# Altium schematic sheet NODE_3_SCH.SchDoc
size A2; SheetNumber: 1; SheetTotal: 1; SPICEModelCacheSGLVFROD: <root> / <DocumentId>SGLVFROD</DocumentId> / <CacheFrame Number="0"> / <Model Name="xtal" Kind="CKT"> / <Text>*Generic type:crystal pkg:HC33/51 / .SUBCKT XTAL 1 2 PARAMS: FREQ=1Meg RS=750 C=13pf Q=1000 / LX 1 3 {((Q*RS)/(6.2831852*FREQ))} IC=0.5M / CX 3 4 {(1/(Q*6.2831852*FREQ*RS))} / C0 1 2 {C} / RS 4 2 {RS} / .ENDS XTAL</Text> / </Model> / </CacheFrame> / </root>
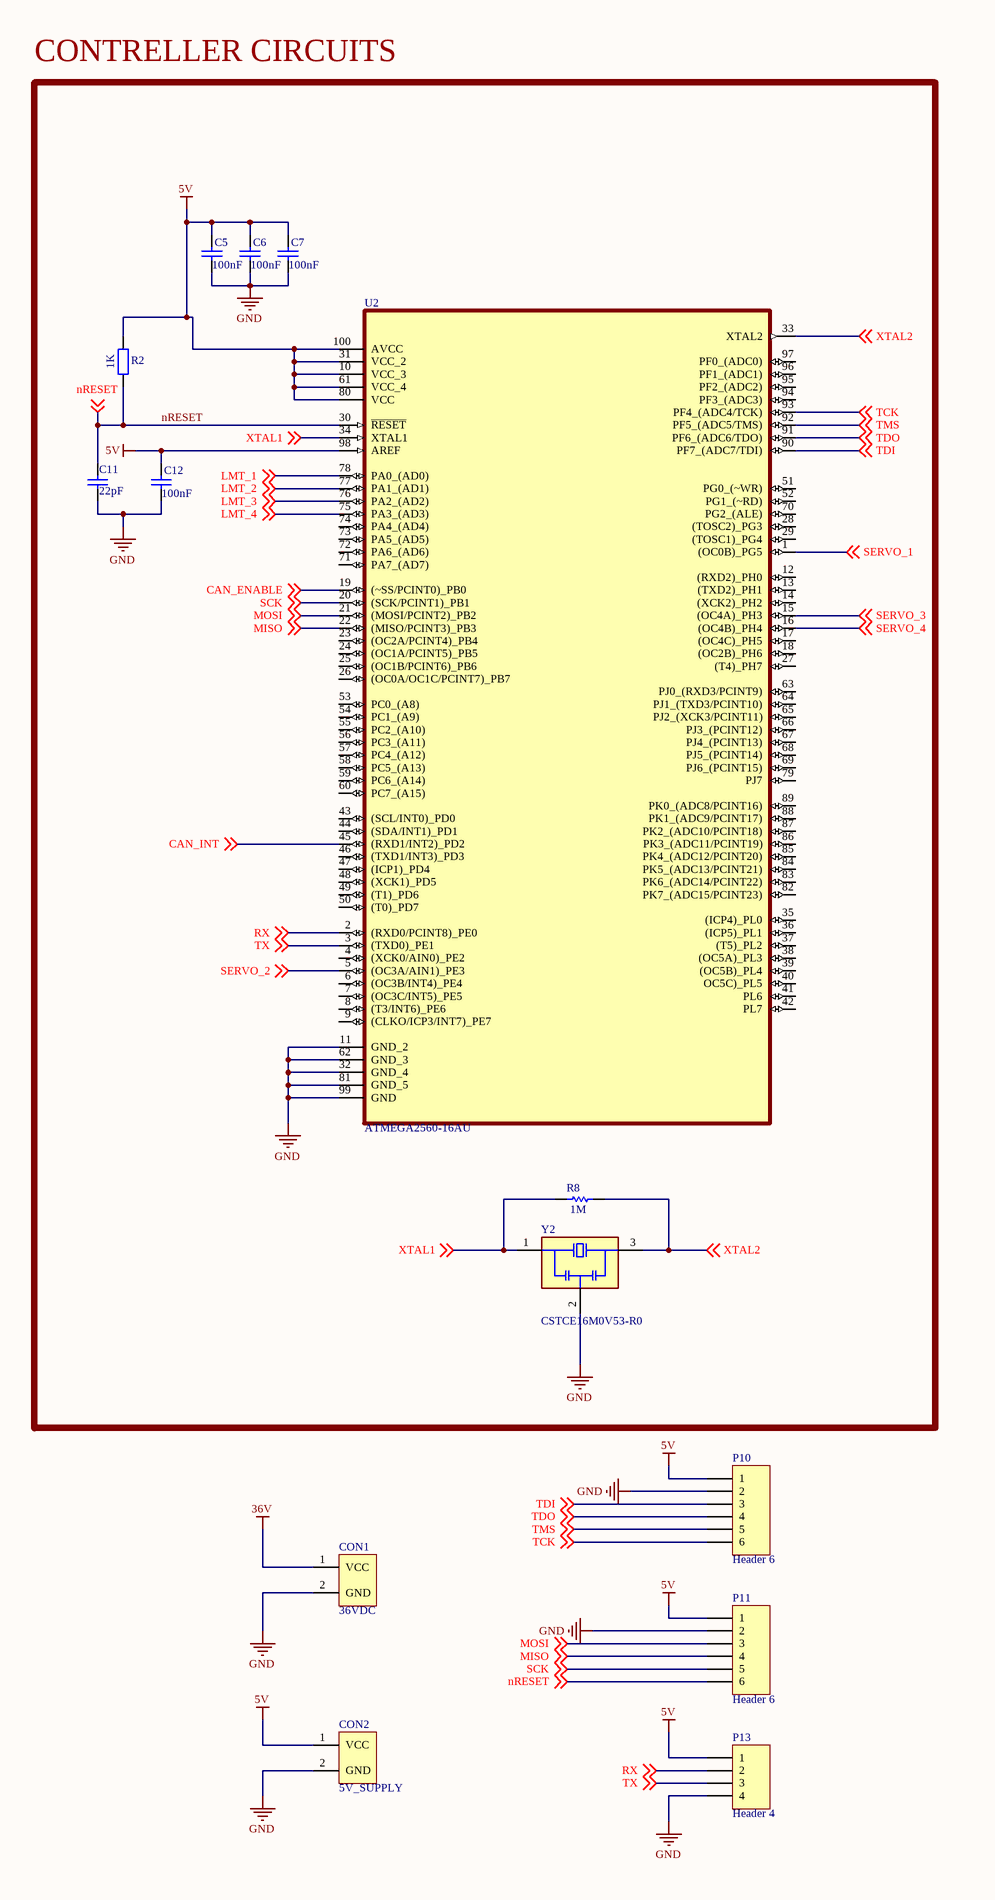
[diagram p0: NODE_3_SCH.SchDoc, left]
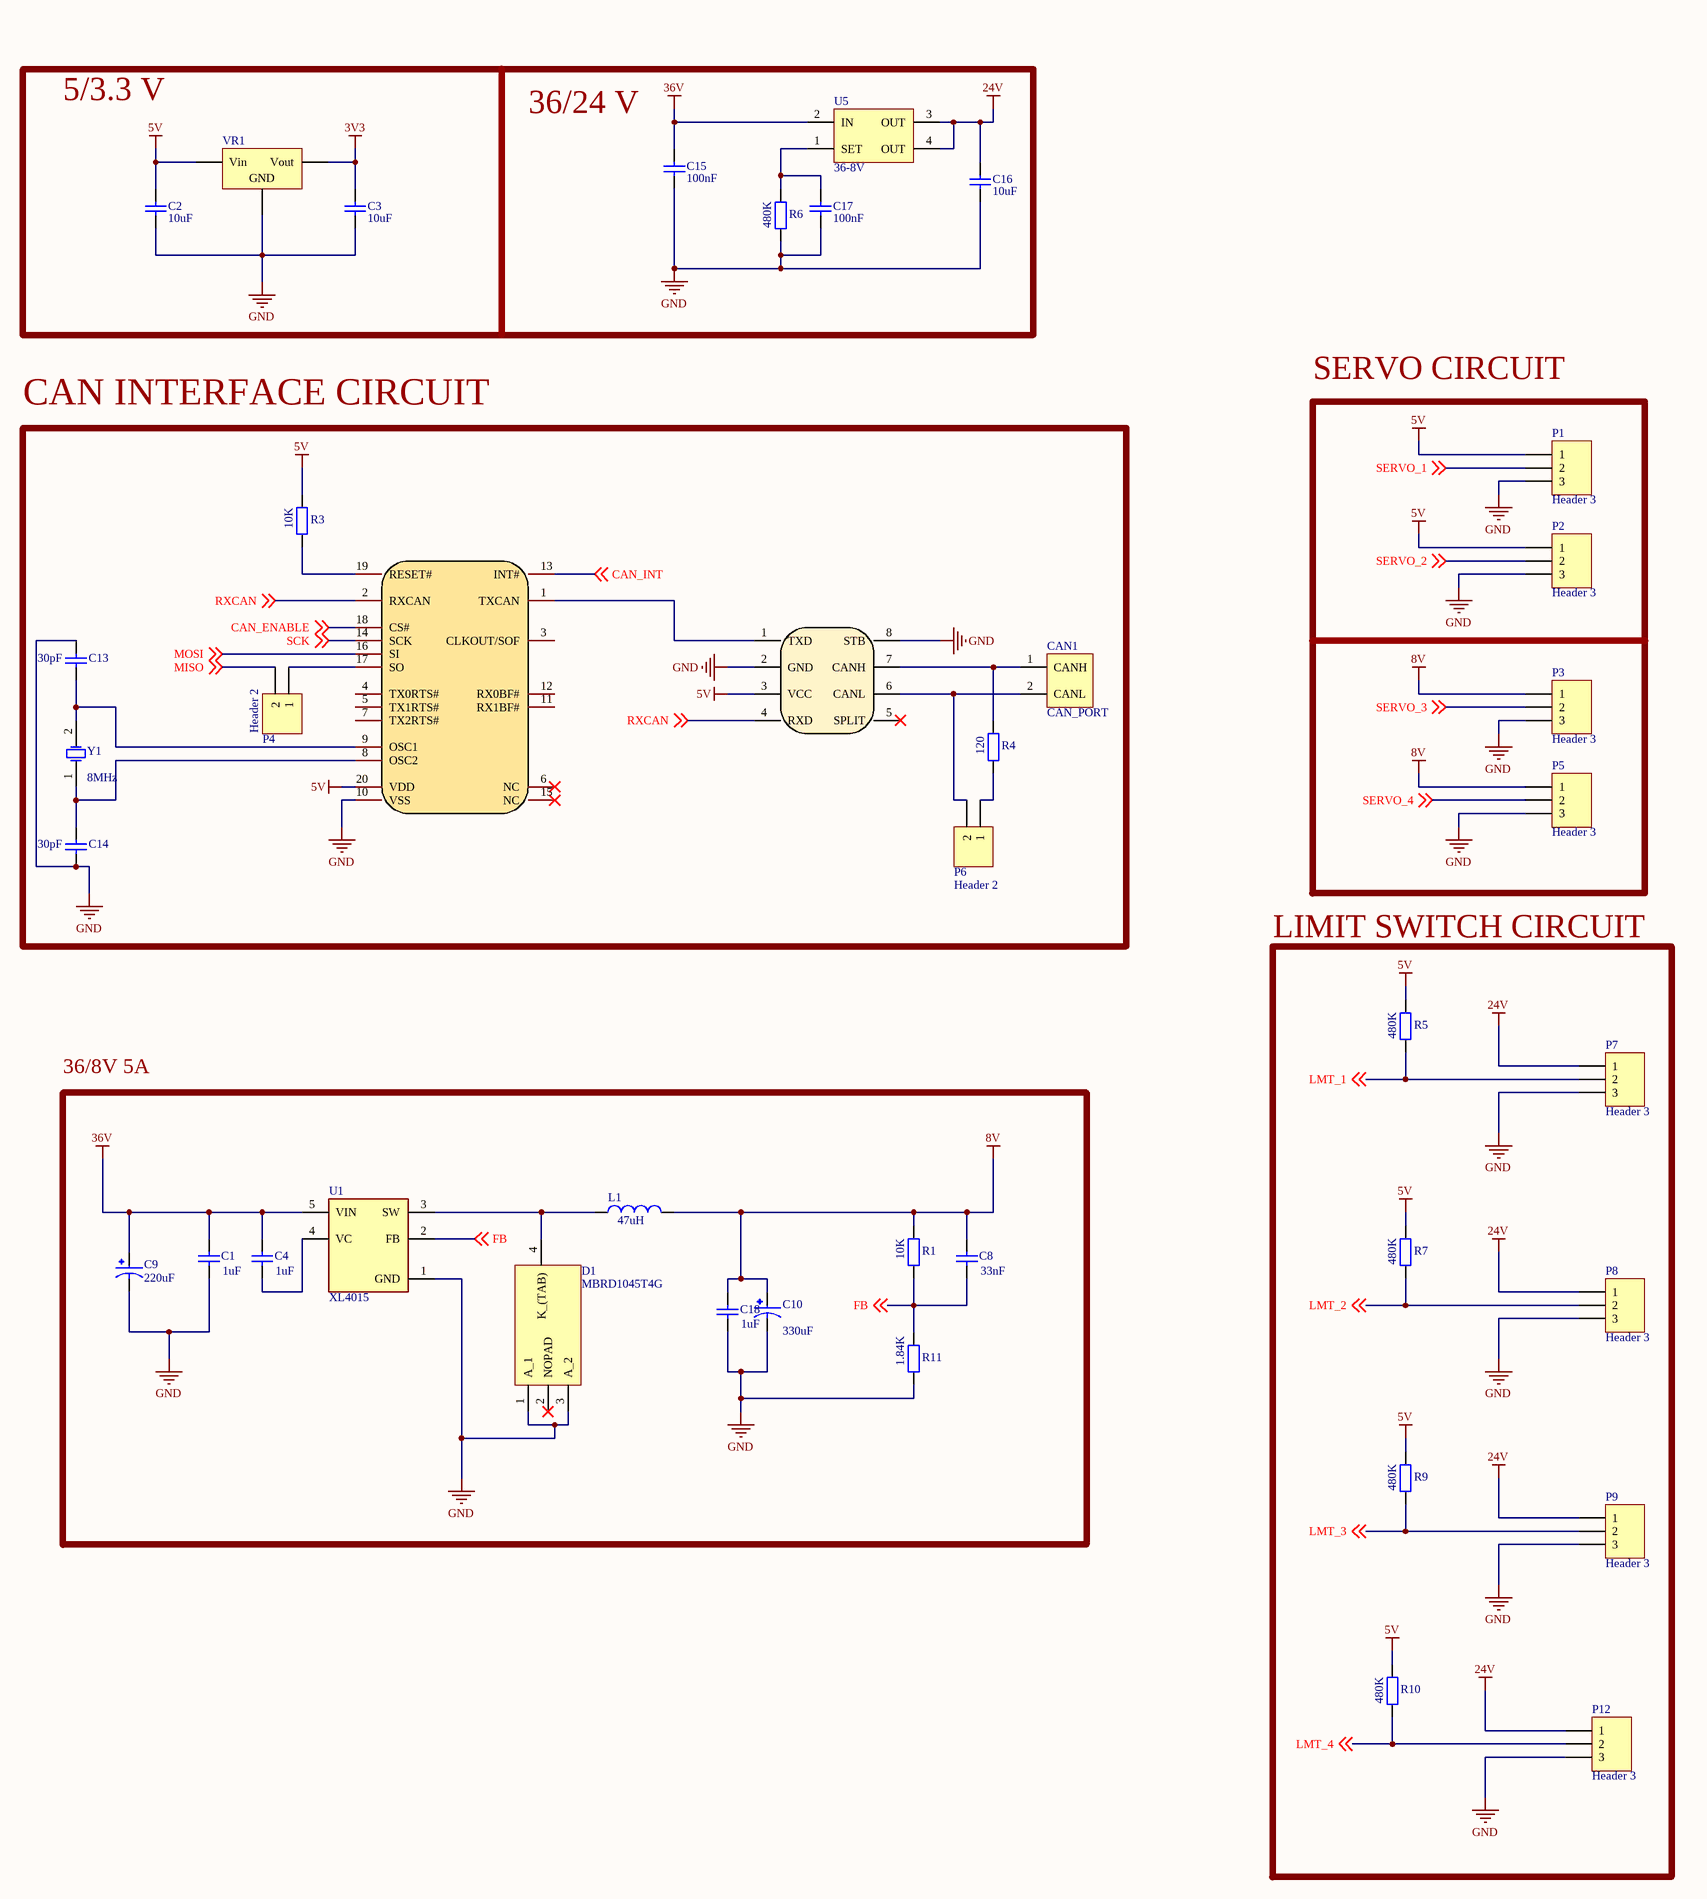
[diagram p1: NODE_3_SCH.SchDoc, right]

## Parts
C1  value 1uF  [CAPC2012X135N]  (hidden comment: Cap)
C2  value 10uF  [CAPC2012X135N]  (hidden comment: Cap)
C3  value 10uF  [CAPC2012X135N]  (hidden comment: Cap)
C4  value 1uF  [CAPC2012X135N]  (hidden comment: Cap)
C5  value 100nF  [CAPC2012X135N]  (hidden comment: Cap)
C6  value 100nF  [CAPC2012X135N]  (hidden comment: Cap)
C7  value 100nF  [CAPC2012X135N]  (hidden comment: Cap)
C8  value 33nF  [CAPC2012X135N]  (hidden comment: Cap)
C9  value 220uF  [CAP_EEVTG1H221Q]  (hidden comment: EEVTG1H221Q)
C10  value 330uF  [CAP_EEEFN1E331V]  (hidden comment: EEEFN1E331V)
C11  value 22pF  [CAPC2012X135N]  (hidden comment: Cap)
C12  value 100nF  [CAPC2012X135N]  (hidden comment: Cap)
C13  value 30pF  [CAPC2012X135N]  (hidden comment: Cap)
C14  value 30pF  [CAPC2012X135N]  (hidden comment: Cap)
C15  value 100nF  [CAPC2012X135N]  (hidden comment: Cap)
C16  value 10uF  [CAPC2012X135N]  (hidden comment: Cap)
C17  value 100nF  [CAPC2012X135N]  (hidden comment: Cap)
C18  value 1uF  [CAPC2012X135N]  (hidden comment: Cap)
CAN1  CAN_PORT  [12V_CON]
CON1  36VDC  [12V_CON]
CON2  5V_SUPPLY  [12V_CON]
D1  MBRD1045T4G  [TO229P990X238-4N]
L1  value 47uH  [IND_MWSA1206S_SNL]  (hidden comment: Inductor)
P1  Header 3  [3PIN_H]
P2  Header 3  [3PIN_H]
P3  Header 3  [3PIN_H]
P4  Header 2  [SAMTEC_TS-102-G-A]
P5  Header 3  [3PIN_H]
P6  Header 2  [SAMTEC_TS-102-G-A]
P7  Header 3  [3PIN_H]
P8  Header 3  [3PIN_H]
P9  Header 3  [3PIN_H]
P10  Header 6  [HDR1X6]
P11  Header 6  [HDR1X6]
P12  Header 3  [3PIN_H]
P13  Header 4  [HDR1X4]
R1  value 10K  [RESC2013X06N]  (hidden comment: Res2)
R2  value 1K  [RESC2013X06N]  (hidden comment: Res2)
R3  value 10K  [RESC2013X06N]  (hidden comment: Res2)
R4  value 120  [CRCW1206120RFKEAHP]  (hidden comment: Res2)
R5  value 480K  [CRCW1206120RFKEAHP]  (hidden comment: Res2)
R6  value 480K  [CRCW1206120RFKEAHP]  (hidden comment: Res2)
R7  value 480K  [CRCW1206120RFKEAHP]  (hidden comment: Res2)
R8  value 1M  [RESC2013X06N]  (hidden comment: Res1)
R9  value 480K  [CRCW1206120RFKEAHP]  (hidden comment: Res2)
R10  value 480K  [CRCW1206120RFKEAHP]  (hidden comment: Res2)
R11  value 1.84K  [0603_STANDARD]  (hidden comment: Res2)
U1  XL4015  [CONV_XL4015]
U2  ATMEGA2560-16AU  [QFP50P1600X1600X120-100N]
U3  TJA1050DRG  [SOP-8_L4.9-W3.9-P1.27-LS6.0-BL - duplicate]  (value not drawn)
U4  MCP2515T-I/ST  [TSSOP-20_L6.5-W4.4-P0.65-LS6.4-BL]  (value not drawn)
U5  36-8V  [SOT-223-3_L6.5-W3.4-P2.30-LS7.0-BR]
VR1  5-3.3V  [TO-252-2_L6.6-W6.1-P4.57-LS9.9-BR-CW]  (value not drawn)
Y1  value 8MHz  [CRYSTAL-SMD_L7.4-W4.0-LS8.0]  (hidden comment: XTAL)
Y2  CSTCE16M0V53-R0  [OSC_CSTCE16M0V53-R0]

## Blocks framed on the sheet
CONTRELLER CIRCUITS: C5-C7 C11 C12 R2 R8 U2 Y2
SERVO CIRCUIT: P1-P3 P5
CAN INTERFACE CIRCUIT: C13 C14 CAN1 P4 P6 R3 R4 U3 U4 Y1
LIMIT SWITCH CIRCUIT: P7-P9 P12 R5 R7 R9 R10
36/8V 5A: C1 C4 C8-C10 C18 D1 L1 R1 R11 U1

## Nets
3V3: C3.2 VR1.3(Vout)
5V: C2.2 C5.1 C6.1 C7.1 C12.1 CON2.1(VCC) P1.1 P2.1 P10.1 P11.1 P13.1 R2.2 R3.2 R5.2 R7.2 R9.2 R10.2 U2.10(VCC_3) U2.31(VCC_2) U2.61(VCC_4) U2.80(VCC) U2.98(AREF) U2.100(AVCC) U3.3(VCC) U4.20(VDD) VR1.1(Vin)
8V: C8.1 C10.1 C18.1 L1.2 P3.1 P5.1 R1.2
24V: C16.2 P7.1 P8.1 P9.1 P12.1 U5.3(OUT) U5.4(OUT)
36V: C1.1 C4.1 C9.1 C15.2 CON1.1(VCC) U1.5(VIN) U5.2(IN)
GND: C1.2 C2.1 C3.1 C5.2 C6.2 C7.2 C9.2 C10.2 C11.2 C12.2 C13.1 C14.2 C15.1 C16.1 C17.1 C18.2 CON1.2(GND) CON2.2(GND) D1.1(A_1) D1.3(A_2) P1.3 P2.3 P3.3 P5.3 P7.3 P8.3 P9.3 P10.2 P11.2 P12.3 P13.4 R6.1 R11.1 U1.1(GND) U2.11(GND_2) U2.32(GND_4) U2.62(GND_3) U2.81(GND_5) U2.99(GND) U3.2(GND) U3.8(STB) U4.10(VSS) VR1.2(GND) Y2.2(GND)
CAN_ENABLE: U2.19((~SS/PCINT0)_PB0) U4.18(CS#) ; off-sheet CAN_ENABLE
CAN_INT: U2.45((RXD1/INT2)_PD2) U4.13(INT#) ; off-sheet CAN_INT
FB: C8.2 R1.1 R11.2 U1.2(FB) ; off-sheet FB
LMT_1: P7.2 R5.1 U2.78(PA0_(AD0)) ; off-sheet LMT_1
LMT_2: P8.2 R7.1 U2.77(PA1_(AD1)) ; off-sheet LMT_2
LMT_3: P9.2 R9.1 U2.76(PA2_(AD2)) ; off-sheet LMT_3
LMT_4: P12.2 R10.1 U2.75(PA3_(AD3)) ; off-sheet LMT_4
MISO: P4.2 P11.4 U2.22((MISO/PCINT3)_PB3) ; off-sheet MISO
MOSI: P11.3 U2.21((MOSI/PCINT2)_PB2) U4.16(SI) ; off-sheet MOSI
nRESET: C11.1 P11.6 R2.1 U2.30(~{RESET}) ; off-sheet nRESET
RX: P13.2 U2.2((RXD0/PCINT8)_PE0) ; off-sheet RX
RXCAN: U3.4(RXD) U4.2(RXCAN) ; off-sheet RXCAN
SCK: P11.5 U2.20((SCK/PCINT1)_PB1) U4.14(SCK) ; off-sheet SCK
SERVO_1: P1.2 U2.1((OC0B)_PG5) ; off-sheet SERVO_1
SERVO_2: P2.2 U2.5((OC3A/AIN1)_PE3) ; off-sheet SERVO_2
SERVO_3: P3.2 U2.15((OC4A)_PH3) ; off-sheet SERVO_3
SERVO_4: P5.2 U2.16((OC4B)_PH4) ; off-sheet SERVO_4
TCK: P10.6 U2.93(PF4_(ADC4/TCK)) ; off-sheet TCK
TDI: P10.3 U2.90(PF7_(ADC7/TDI)) ; off-sheet TDI
TDO: P10.4 U2.91(PF6_(ADC6/TDO)) ; off-sheet TDO
TMS: P10.5 U2.92(PF5_(ADC5/TMS)) ; off-sheet TMS
TX: P13.3 U2.3((TXD0)_PE1) ; off-sheet TX
XTAL1: R8.1 U2.34(XTAL1) Y2.1(IN) ; off-sheet XTAL1
XTAL2: R8.2 U2.33(XTAL2) Y2.3(OUT) ; off-sheet XTAL2
NetC4_2: C4.2 U1.4(VC)
NetC13_2: C13.2 U4.9(OSC1) Y1.2(OSC2)
NetC14_1: C14.1 U4.8(OSC2) Y1.1(OSC1)
NetC17_2: C17.2 R6.2 U5.1(SET)
NetCAN1_1: CAN1.1(CANH) R4.2 U3.7(CANH)
NetCAN1_2: CAN1.2(CANL) P6.2 U3.6(CANL)
NetD1_4: D1.4(K_(TAB)) L1.1 U1.3(SW)
NetP4_1: P4.1 U4.17(SO)
NetP6_1: P6.1 R4.1
NetR3_1: R3.1 U4.19(RESET#)
NetU3_1: U3.1(TXD) U4.1(TXCAN)

Not connected (* = marked no-connect by the designer): D1 2(NOPAD)*; U2 4((XCK0/AIN0)_PE2) 6((OC3B/INT4)_PE4) 7((OC3C/INT5)_PE5) 8((T3/INT6)_PE6) 9((CLKO/ICP3/INT7)_PE7) 12((RXD2)_PH0) 13((TXD2)_PH1) 14((XCK2)_PH2) 17((OC4C)_PH5) 18((OC2B)_PH6) 23((OC2A/PCINT4)_PB4) 24((OC1A/PCINT5)_PB5) 25((OC1B/PCINT6)_PB6) 26((OC0A/OC1C/PCINT7)_PB7) 27((T4)_PH7) 28((TOSC2)_PG3) 29((TOSC1)_PG4) 35((ICP4)_PL0) 36((ICP5)_PL1) 37((T5)_PL2) 38((OC5A)_PL3) 39((OC5B)_PL4) 40(OC5C)_PL5) 41(PL6) 42(PL7) 43((SCL/INT0)_PD0) 44((SDA/INT1)_PD1) 46((TXD1/INT3)_PD3) 47((ICP1)_PD4) 48((XCK1)_PD5) 49((T1)_PD6) 50((T0)_PD7) 51(PG0_(~WR)) 52(PG1_(~RD)) 53(PC0_(A8)) 54(PC1_(A9)) 55(PC2_(A10)) 56(PC3_(A11)) 57(PC4_(A12)) 58(PC5_(A13)) 59(PC6_(A14)) 60(PC7_(A15)) 63(PJ0_(RXD3/PCINT9)) 64(PJ1_(TXD3/PCINT10)) 65(PJ2_(XCK3/PCINT11)) 66(PJ3_(PCINT12)) 67(PJ4_(PCINT13)) 68(PJ5_(PCINT14)) 69(PJ6_(PCINT15)) 70(PG2_(ALE)) 71(PA7_(AD7)) 72(PA6_(AD6)) 73(PA5_(AD5)) 74(PA4_(AD4)) 79(PJ7) 82(PK7_(ADC15/PCINT23)) 83(PK6_(ADC14/PCINT22)) 84(PK5_(ADC13/PCINT21)) 85(PK4_(ADC12/PCINT20)) 86(PK3_(ADC11/PCINT19)) 87(PK2_(ADC10/PCINT18)) 88(PK1_(ADC9/PCINT17)) 89(PK0_(ADC8/PCINT16)) 94(PF3_(ADC3)) 95(PF2_(ADC2)) 96(PF1_(ADC1)) 97(PF0_(ADC0)); U3 5(SPLIT)*; U4 3(CLKOUT/SOF) 4(TX0RTS#) 5(TX1RTS#) 6(NC)* 7(TX2RTS#) 11(RX1BF#) 12(RX0BF#) 15(NC)*

## Notes on the sheet
- 5/3.3 V
- (near C15) 36/24 V

## Library data of the parts
C1 C4 C18 = Cap: Capacitor; Part Number: CL21B105KBFNNNE; Published: 8-Jun-2000; LatestRevisionDate: 17-Jul-2002; LatestRevisionNote: Re-released for DXP Platform.; PackageReference: RAD-0.3; Publisher: Altium Limited; PackageDescription: Radial Cap, Thru-Hole; 2 Leads; 0.3 in Pin Spacing
C2 C3 C16 = Cap: Capacitor; Part Number: CL21A106KOQNNNE; Published: 8-Jun-2000; LatestRevisionDate: 17-Jul-2002; LatestRevisionNote: Re-released for DXP Platform.; PackageReference: RAD-0.3; Publisher: Altium Limited; PackageDescription: Radial Cap, Thru-Hole; 2 Leads; 0.3 in Pin Spacing
C5-C7 C12 C15 C17 = Cap: Capacitor; Part Number: TCC0805X7R104M500DT; Published: 8-Jun-2000; LatestRevisionDate: 17-Jul-2002; LatestRevisionNote: Re-released for DXP Platform.; PackageReference: RAD-0.3; Publisher: Altium Limited; PackageDescription: Radial Cap, Thru-Hole; 2 Leads; 0.3 in Pin Spacing
  C15 C17: PN: TCC0805X7R104M500DT
C8 = Cap: Capacitor; Part Number: TCC0805X7R333M500DT; Published: 8-Jun-2000; LatestRevisionDate: 17-Jul-2002; LatestRevisionNote: Re-released for DXP Platform.; PackageReference: RAD-0.3; Publisher: Altium Limited; PackageDescription: Radial Cap, Thru-Hole; 2 Leads; 0.3 in Pin Spacing
C9 = EEVTG1H221Q: 220ÂµF 50V Aluminum Electrolytic Capacitors Radial, Can - SMD 230mOhm @ 100kHz 2000 Hrs @ 125Â°C; Part Number: EEV-TG1H221Q; MF: Panasonic Electronic; Availability: No availability data; Price: None; Package: RADIAL-2 Panasonic; SnapEDA_Link: https://www.snapeda.com/parts/EEV-TG1H221Q/Panasonic%20Electronic%20Components/view-part/1236528/?ref=snap; Check_prices: https://www.snapeda.com/parts/EEV-TG1H221Q/Panasonic%20Electronic%20Components/view-part/1236528/?ref=eda; Purchase-URL: https://pricing.snapeda.com/search/part/EEV-TG1H221Q/?ref=eda
C10 = EEEFN1E331V: CAP ALUM 330UF 20% 25V SMD; MF: Panasonic; Check_prices: https://www.snapeda.com/parts/EEEFN1E331V/Panasonic/view-part/5787983/?ref=eda; Digi-Key_Part_Number: 10-EEE-FN1E331VTR-ND; Part Number: EEEFN1E331V; Package: RADIAL-2 Panasonic; SnapEDA_Link: https://www.snapeda.com/parts/EEEFN1E331V/Panasonic/view-part/5787983/?ref=snap
C11 = Cap: Capacitor; Part Number: TCC0805COG220J500BT; Published: 8-Jun-2000; LatestRevisionDate: 17-Jul-2002; LatestRevisionNote: Re-released for DXP Platform.; PackageReference: RAD-0.3; Publisher: Altium Limited; PackageDescription: Radial Cap, Thru-Hole; 2 Leads; 0.3 in Pin Spacing
C13 C14 = Cap: Capacitor; Part Number: TCC0805COG300J500BT; Published: 8-Jun-2000; LatestRevisionDate: 17-Jul-2002; LatestRevisionNote: Re-released for DXP Platform.; PackageReference: RAD-0.3; Publisher: Altium Limited; PackageDescription: Radial Cap, Thru-Hole; 2 Leads; 0.3 in Pin Spacing
CAN1 = 2PIN_CON_1: Part Number: MX126-5.0-02P-GN01-Cu-S-A
CON1 = 2PIN_CON_2: Part Number: MX126-5.0-02P-GN01-Cu-S-A
CON2 = 2PIN_CON: Part Number: MX126-5.0-02P-GN01-Cu-S-A
D1 = MBRD1045T4G: Diode Schottky 45V 10A Surface Mount DPAK; MF: ON Semiconductor; SnapEDA_Link: https://www.snapeda.com/parts/MBRD1045T4G/ON%20Semiconductor/view-part/326366/?ref=snap; Value: 10A; Purchase-URL: https://pricing.snapeda.com/search/part/MBRD1045T4G/?ref=eda; Check_prices: https://www.snapeda.com/parts/MBRD1045T4G/ON%20Semiconductor/view-part/326366/?ref=eda; Price: None; Availability: Warning; Part Number: MBRD1045T4G; Package: DPAK-3 ON Semiconductor
L1 = Inductor: Part Number: MWSA1206S-470MT; Code_IEC: 1005; Published: 8-Jun-2000; LatestRevisionDate: 29-May-2009; LatestRevisionNote: IPC-7351 Footprint Added.; PackageReference: 0402-A; Publisher: Altium Limited; PackageDescription: Chip Inductor; Code_JEITA: 0402
P1-P3 P5 P7-P9 P12 = Header 3: Header, 3-Pin; Part Number: DB125-3.81-3P-BK-S; LatestRevisionDate: 17-Jul-2002; LatestRevisionNote: Re-released for DXP Platform.; Publisher: Altium Limited
  P3: ComponentLink1Description: DATA SHEET; ComponentLink1URL: https://cdn.shopify.com/s/files/1/0570/1766/3541/files/DS525_Technical_Specification.pdf?v=1700473172
P4 P6 = Header 2: Header, 2-Pin; Part Number: PH-01078; LatestRevisionDate: 17-Jul-2002; LatestRevisionNote: Re-released for DXP Platform.; Publisher: Altium Limited
P10 P11 = Header 6: Header, 6-Pin; Part Number: HB-PH3-25414PB2GOP; LatestRevisionDate: 17-Jul-2002; LatestRevisionNote: Re-released for DXP Platform.; Publisher: Altium Limited
P13 = Header 4: Header, 4-Pin; Part Number: P125-1106A0BS116A1; LatestRevisionDate: 17-Jul-2002; LatestRevisionNote: Re-released for DXP Platform.; Publisher: Altium Limited
R1 R3 = Res2: Resistor; Part Number: RC0805JR-0710KL; Published: 8-Jun-2000; LatestRevisionDate: 17-Jul-2002; LatestRevisionNote: Re-released for DXP Platform.; PackageReference: AXIAL-0.4; Publisher: Altium Limited; PackageDescription: Axial Device, Thru-Hole; 2 Leads; 0.4 in Pin Spacing
R2 = Res2: Resistor; Part Number: 0805W8J0102T5E; Published: 8-Jun-2000; LatestRevisionDate: 17-Jul-2002; LatestRevisionNote: Re-released for DXP Platform.; PackageReference: AXIAL-0.4; Publisher: Altium Limited; PackageDescription: Axial Device, Thru-Hole; 2 Leads; 0.4 in Pin Spacing
R4 = Res2: Resistor; Published: 8-Jun-2000; LatestRevisionDate: 17-Jul-2002; LatestRevisionNote: Re-released for DXP Platform.; PackageReference: AXIAL-0.4; Publisher: Altium Limited; PackageDescription: Axial Device, Thru-Hole; 2 Leads; 0.4 in Pin Spacing; Part Number: CRCW1206120RFKEAHP
R5-R7 R9 R10 = Res2: Resistor; Part Number: 1206W4J0484T5E; Published: 8-Jun-2000; LatestRevisionDate: 17-Jul-2002; LatestRevisionNote: Re-released for DXP Platform.; PackageReference: AXIAL-0.4; Publisher: Altium Limited; PackageDescription: Axial Device, Thru-Hole; 2 Leads; 0.4 in Pin Spacing
R8 = Res1: Resistor; Part Number: RC0805JR-071KL; Published: 8-Jun-2000; LatestRevisionDate: 17-Jul-2002; LatestRevisionNote: Re-released for DXP Platform.; PackageReference: AXIAL-0.3; Publisher: Altium Limited; PackageDescription: Axial Device, Thru-Hole; 2 Leads; 0.3 in Pin Spacing
R11 = Res2: Resistor; Part Number: RT0603BRD071K84L; Published: 8-Jun-2000; LatestRevisionDate: 17-Jul-2002; LatestRevisionNote: Re-released for DXP Platform.; PackageReference: AXIAL-0.4; Publisher: Altium Limited; PackageDescription: Axial Device, Thru-Hole; 2 Leads; 0.4 in Pin Spacing
U1 = XL4015: 5A 180KHz 36V Buck DC to DC Converter; Part Number: XL4015E1; Value: DC/DC BUCK; Price: None; Availability: Unavailable; Package: None; ComponentLink1Description: DATA SHEET; ComponentLink1URL: https://components101.com/sites/default/files/component_datasheet/XL4015-DC-DC-Module-Datasheet.pdf
U2 = ATMEGA2560-16AU: AVR AVRÂ® ATmega Microcontroller IC 8-Bit 16MHz 256KB (128K x 16) FLASH 100-TQFP (14x14); MF: Microchip; Package: TQFP-100 Microchip; Price: None; Check_prices: https://www.snapeda.com/parts/ATMEGA2560-16AU/Microchip/view-part/?ref=eda; Value: *; SnapEDA_Link: https://www.snapeda.com/parts/ATMEGA2560-16AU/Microchip/view-part/?ref=snap; Part Number: ATMEGA2560-16AU; Availability: In Stock; Purchase-URL: https://pricing.snapeda.com/search?q=ATMEGA2560-16AU&ref=eda
U3 = TJA1050DRG: Manufacturer: HGC(深圳汉芯); Add into BOM: yes; Symbol: TJA1050DRG; Device: TJA1050DRG; LCSC Part Name: TJA1050DRG; Supplier Part: C19723770; Part Number: TJA1050DRG; Supplier Footprint: SOP-8; JLCPCB Part Class: Extended Part; Datasheet: https://atta.szlcsc.com/upload/public/pdf/source/20231229/9EC40A6172CAB0350BF7AF3421F4DEBF.pdf; Supplier: LCSC; Convert to PCB: yes
U4 = MCP2515T-I/ST: Manufacturer: MICROCHIP(美国微芯); Add into BOM: yes; Supply Voltage: 2.7V~5.5V; Supply Current: 10mA; Symbol: MCP2515T-I/ST; Device: MCP2515T-I/ST; LCSC Part Name: 2.7V~5.5V; Supplier Part: C185941; Part Number: MCP2515T-I/ST; Supplier Footprint: TSSOP-20; JLCPCB Part Class: Extended Part; Datasheet: https://atta.szlcsc.com/upload/public/pdf/source/20180521/C185941_CF4E8B602AE128DB1B8E6B0AB1F829A7.pdf; Supplier: LCSC; Convert to PCB: yes; Operating Temperature: -40℃~+85℃
U5 = LT3088MPST#PBF: LDO Regulator Pos 0V to 34.5V 0.8A Automotive 4-Pin(3+Tab) SOT-223 Tube; Manufacturer: Analog Devices / Linear Technology; Supplier: Mouser; Supplier Part Number: 584-LT3088MPST#PBF; Part Number: LT3088MPST#PBF; RoHS: Yes; Category: Voltage Regulators - Linear; Stock: 477; Pricing: 1=13.29, 10=12.21, 50=11.71, 100=10.32, 1000=9.18, 10000=9.18 (USD); ComponentLink1URL: http://www.linear.com/docs/46566?src-supplier=Digikey; ComponentLink1Description: http://www.linear.com/docs/46566?src-supplier=Digikey
VR1 = Volt Reg: Voltage Regulator; Part Number: AP7363-33D-13; Published: 24-Mar-1999; LatestRevisionDate: 29-May-2009; LatestRevisionNote: IPC-7351 Footprint Added.; PackageReference: D2PAK; Publisher: Altium Limited; PackageDescription: 3-Pin Transistor Outline Package 2.54 mm Pitch, 15.1 mm Lead Span
Y1 = XTAL: Crystal Oscillator; Part Number: S47SMD8.000M12PF20R30B3; Published: 8-Jun-2000; LatestRevisionDate: 17-Jul-2002; LatestRevisionNote: Re-released for DXP Platform.; PackageReference: R38; Publisher: Altium Limited; PackageDescription: Crystal, Thru-Hole; 2 Leads; Body 3.1 x 8.2 mm (Dia.xH)
Y2 = CSTCE16M0V53-R0: 16 MHz Ceramic Resonator Built in Capacitor 15 pF Â±0.3% -20Â°C ~ 80Â°C Surface Mount; MF: Murata; Value: 16MHz; Price: None; Package: SMD-3 Murata; Purchase-URL: https://pricing.snapeda.com/search/part/CSTCE16M0V53-R0/?ref=eda; Availability: In Stock; SnapEDA_Link: https://www.snapeda.com/parts/CSTCE16M0V53-R0/Murata+Electronics+North+America/view-part/?ref=snap; Part Number: CSTCE16M0V53-R0; Check_prices: https://www.snapeda.com/parts/CSTCE16M0V53-R0/Murata+Electronics+North+America/view-part/?ref=eda